# Altium schematic sheet Принципиальная схема Peggy Tracker.SchDoc
size 420 x 297 mm; ENG_APP_DATE: --/--/--; DSN_APP_DATE: --/--/--; CHK_APP_DATE: --/--/--; Scale: 1:1; Разраб.: Иванов; Обозначение документа: АБВГ.123456.001 Э3; Пров.: Петров; Утв.: Сидоров; Наименование организации: ОАО "Ваша фирма"; Перв. применение: АБВГ.123456.000; Наименование изделия 1: Плата; Наименование изделия 2: Схема электрическая; Наименование изделия 3: принципиальная; Нач. отд.: Нач. отд.; Фамилия нач. отд.: Сидоров
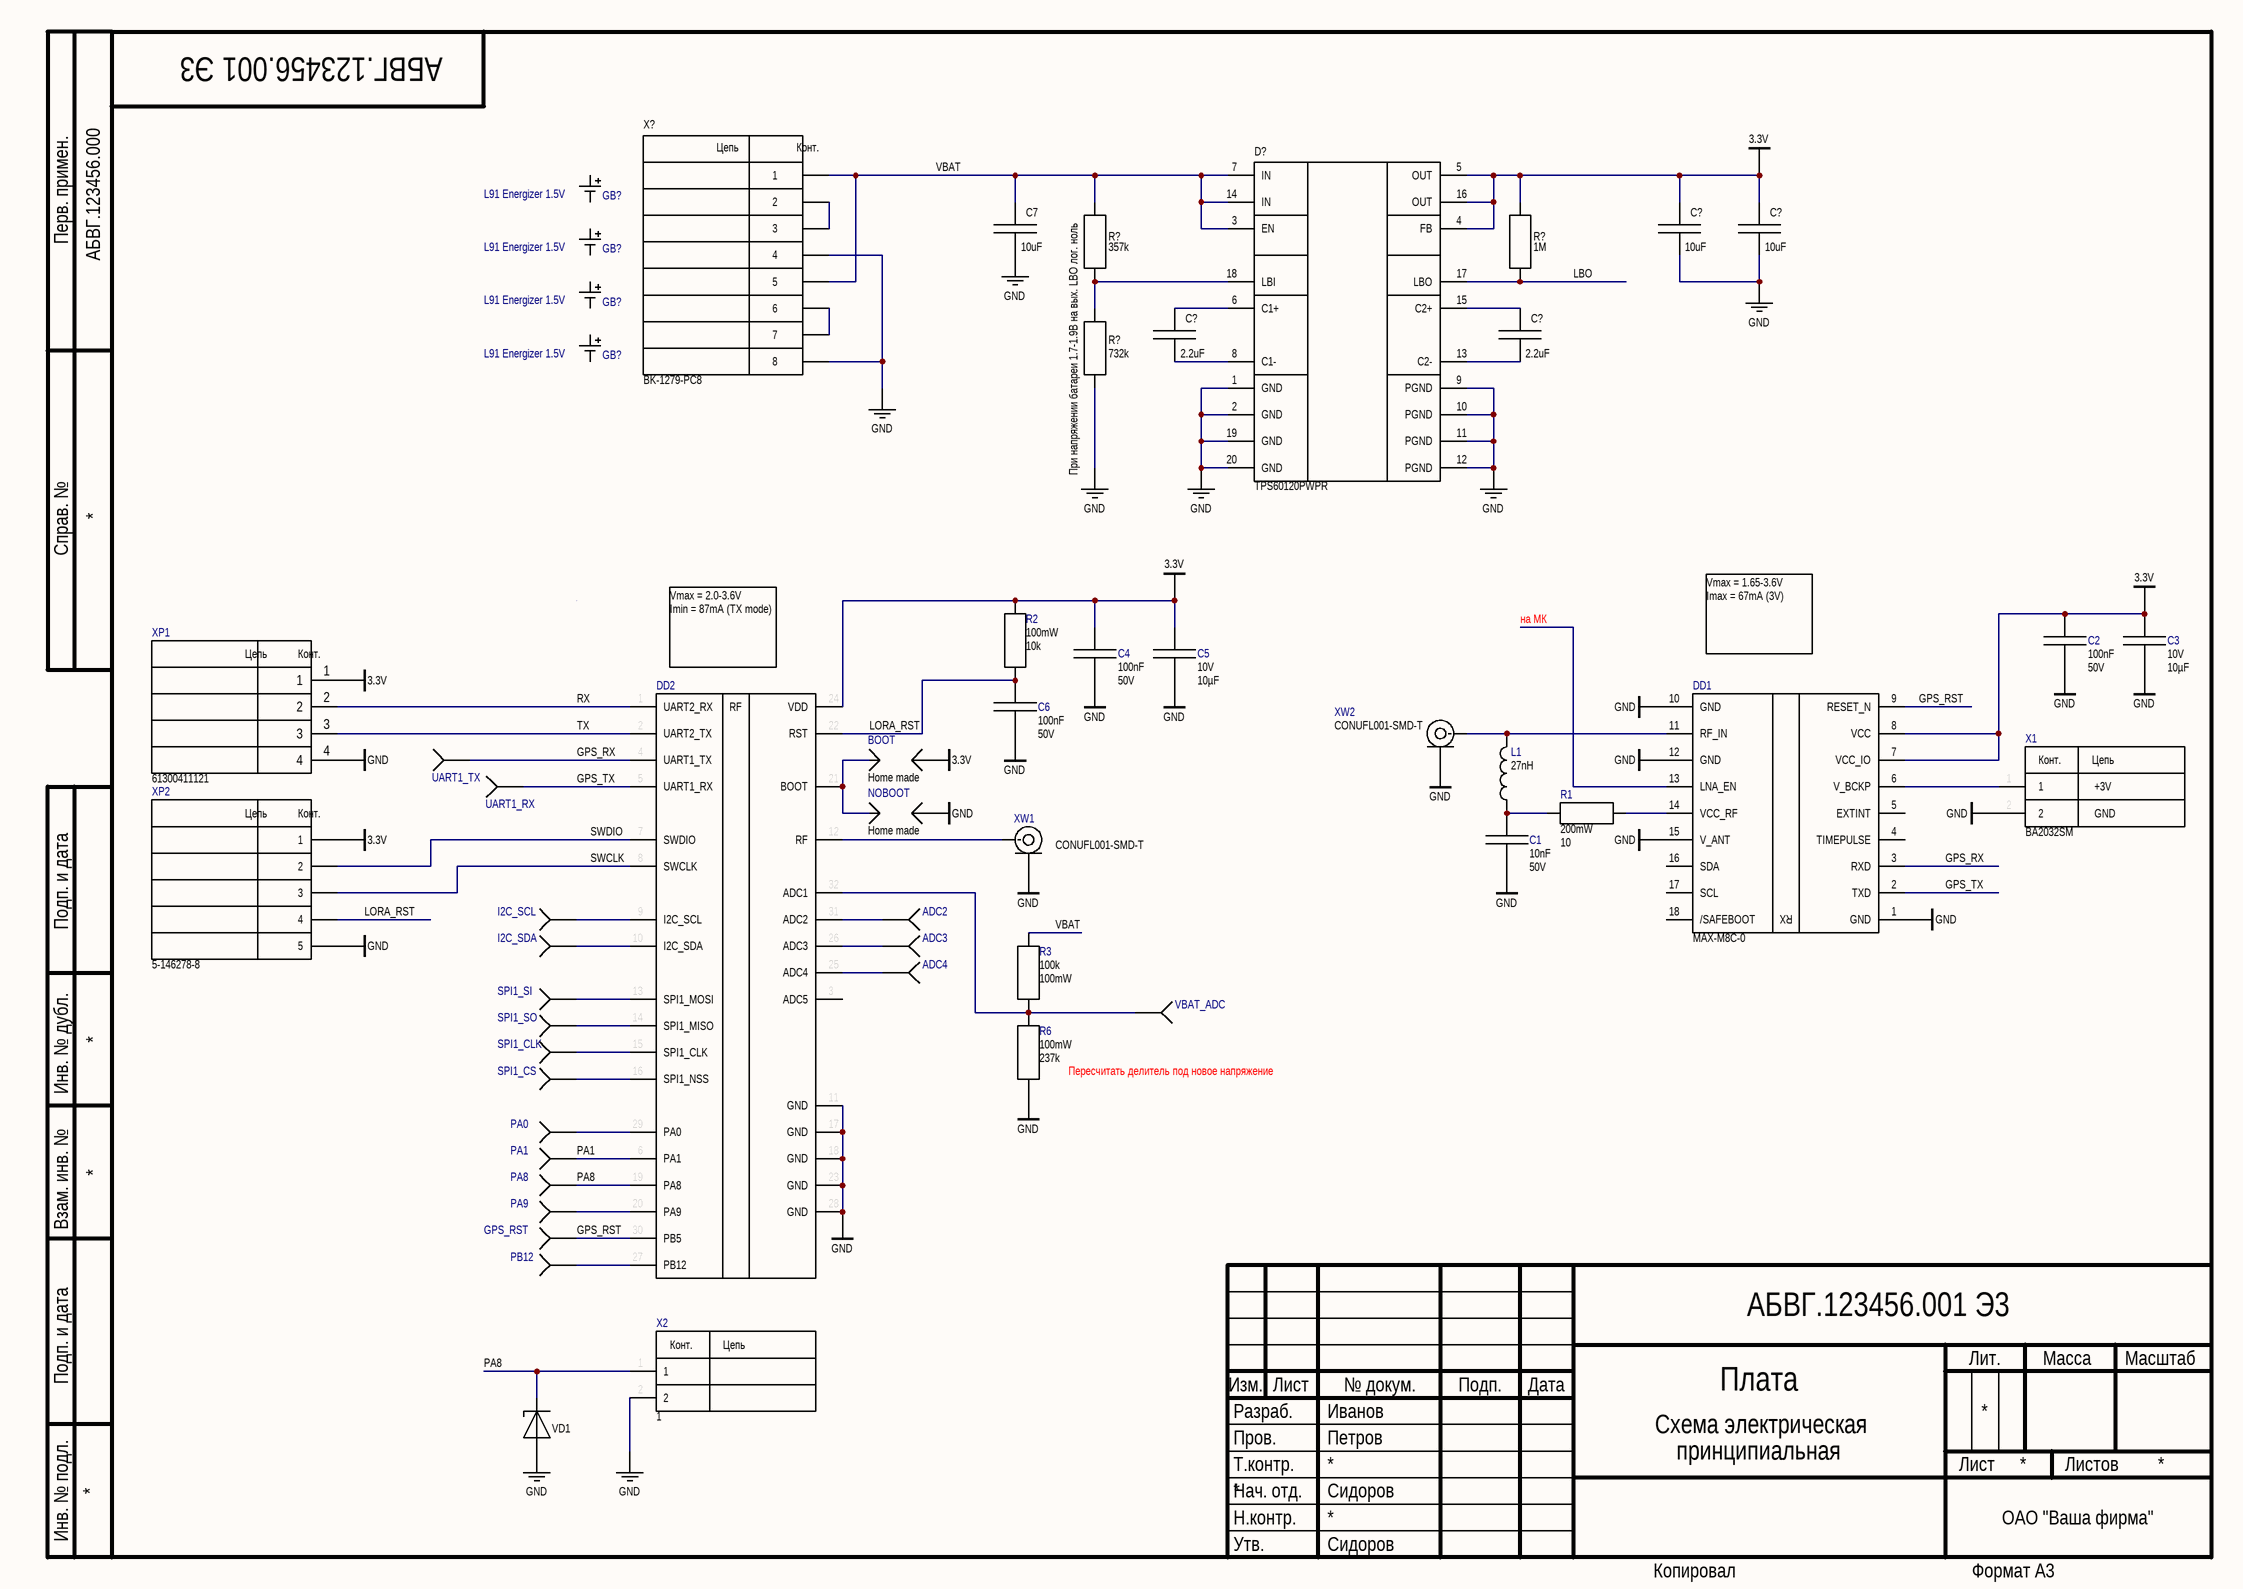
[diagram p0: Принципиальная схема Peggy Tracker.SchDoc]

## Parts
(Parts that share a designator on the sheet are numbered #1, #2 ... from top to bottom, then left to right.)
ADC2  TP_1MM  [New footprint 1]  (value not drawn)
ADC3  TP_1MM  [New footprint 1]  (value not drawn)
ADC4  TP_1MM  [New footprint 1]  (value not drawn)
BOOT  Manufacturer Part Number: Home made  [JUMPER-Footprint-3]  (hidden comment: Jumper_solderable)
C1  value 10nF  Voltage Rating: 50V  [CAPC1608X09N]  (hidden comment: GCM188R71H103KA37D)
C2  value 100nF  Voltage Rating: 50V  [CAPC1608X09N]  (hidden comment: GCM188R71H104KA57D)
C3  Voltage Rating: 10V  Capacitance: 10µF  [CAPC2013X135X45NL10T25]  (hidden comment: CL21Y106KPQVPNE)
C4  value 100nF  Voltage Rating: 50V  [CAPC1608X09N]  (hidden comment: GCM188R71H104KA57D)
C5  Voltage Rating: 10V  Capacitance: 10µF  [CAPC2013X135X45NL10T25]  (hidden comment: CL21Y106KPQVPNE)
C6  value 100nF  Voltage Rating: 50V  [CAPC1608X09N]  (hidden comment: GCM188R71H104KA57D)
C7  10uF  [CH1206C]
C?#1  10uF  [CH1206C]
C?#2  10uF  [CH1206C]
C?#3  2.2uF  [CH0805C]
C?#4  2.2uF  [CH0805C]
D?  TPS60120PWPR  [20-TSSOP (PAD)]
DD1  MAX-M8C-0  [MAXM8C0]
DD2  RAK3172(H)  [RAK3172(H)-Footprint-1]  (value not drawn)
GB?#1  L91 Energizer 1.5V  (mechanical)
GB?#2  L91 Energizer 1.5V  (mechanical)
GB?#3  L91 Energizer 1.5V  (mechanical)
GB?#4  L91 Energizer 1.5V  (mechanical)
GPS_RST  TP_1MM  [New footprint 1]  (value not drawn)
I2C_SCL  TP_1MM  [New footprint 1]  (value not drawn)
I2C_SDA  TP_1MM  [New footprint 1]  (value not drawn)
L1  Inductance: 27nH  [INDC1608X10M]  (hidden comment: LQW18AN27NJ00D)
NOBOOT  Manufacturer Part Number: Home made  [JUMPER-Footprint-3]  (hidden comment: Jumper_solderable)
PA0  TP_1MM  [New footprint 1]  (value not drawn)
PA1  TP_1MM  [New footprint 1]  (value not drawn)
PA8  TP_1MM  [New footprint 1]  (value not drawn)
PA9  TP_1MM  [New footprint 1]  (value not drawn)
PB12  TP_1MM  [New footprint 1]  (value not drawn)
R1  value 10  Power Rating: 200mW  [RESC1608X55X25ML10T15]  (hidden comment: SG73P1JTTD100J)
R2  Power Rating: 100mW  Resistance: 10k  [RESC1608X55X25NL10T15]  (hidden comment: RMCF0603FT10K0)
R3  Resistance: 100k  Power Rating: 100mW  [RESC1608X55X25LL10T15]  (hidden comment: RMCF0603FT100K)
R6  Power Rating: 100mW  Resistance: 237k  [RESC1608X55X25ML10T15]  (hidden comment: ERJ-3EKF2373V)
R?#1  357k  [CH0603R]
R?#2  1M  [CH0603R]
R?#3  732k  [CH0603R]
SPI1_CLK  TP_1MM  [New footprint 1]  (value not drawn)
SPI1_CS  TP_1MM  [New footprint 1]  (value not drawn)
SPI1_SI  TP_1MM  [New footprint 1]  (value not drawn)
SPI1_SO  TP_1MM  [New footprint 1]  (value not drawn)
UART1_RX  TP_1MM  [New footprint 1]  (value not drawn)
UART1_TX  TP_1MM  [New footprint 1]  (value not drawn)
VBAT_ADC  TP_1MM  [New footprint 1]  (value not drawn)
VD1  DESD3V3S1BL-7B  [X1-DFN1006-2 (0402 )]  (value not drawn)
X1  BA2032SM  [MPD-BA2032SM_V]
X2  Manufacturer Part Number: 1  [JST-B2P-VH(LF)(SN)_V]  (hidden comment: B2P-VH(LF)(SN))
X?  BK-1279-PC8  [CON: 0533750810]
XP1  61300411121  [20021311-00010T4LF-Footprint-1]
XP2  Manufacturer Part Number: 5-146278-8  [5-146278-8-Footprint-1]  (hidden comment: 5-146278-5)
XW1  CONUFL001-SMD-T  [u.Fl]
XW2  CONUFL001-SMD-T  [u.Fl]

## Nets
3.3V: BOOT.2 C2.1 C3.2 C4.2 C5.2 C?#1.1 C?#2.1 D?.4(FB) D?.5(OUT) D?.16(OUT) DD1.7(VCC_IO) DD1.8(VCC) DD2.24(VDD) R2.2 R?#2.2 XP1.1 XP2.1
GND: C1.2 C2.2 C3.1 C4.1 C5.1 C6.1 C7.2 C?#1.2 C?#2.2 D?.1(GND) D?.2(GND) D?.9(PGND) D?.10(PGND) D?.11(PGND) D?.12(PGND) D?.19(GND) D?.20(GND) DD1.1(GND) DD1.10(GND) DD1.12(GND) DD1.15(V_ANT) DD2.11(GND) DD2.17(GND) DD2.18(GND) DD2.23(GND) DD2.28(GND) NOBOOT.2 R6.1 R?#3.1 VD1.1(A) X1.2(GND) X2.2 X?.4 X?.8 XP1.4 XP2.5 XW1.2(IN) XW2.2(IN)
GPS_RST: DD1.9(RESET_N) DD2.30(PB5) GPS_RST.1
GPS_RX: DD1.3(RXD) DD2.4(UART1_TX) UART1_TX.1
GPS_TX: DD1.2(TXD) DD2.5(UART1_RX) UART1_RX.1
LBO: D?.17(LBO) R?#2.1
LORA_RST: C6.2 DD2.22(RST) R2.1 XP2.4
PA1: DD2.6(PA1) PA1.1
PA8: DD2.19(PA8) PA8.1 VD1.2(C) X2.1
RX: DD2.1(UART2_RX) XP1.2
SWCLK: DD2.8(SWCLK) XP2.3
SWDIO: DD2.7(SWDIO) XP2.2
TX: DD2.2(UART2_TX) XP1.3
VBAT: C7.1 D?.3(EN) D?.7(IN) D?.14(IN) R3.2 R?#1.2 X?.1 X?.5
NetADC2_1: ADC2.1 DD2.31(ADC2)
NetADC3_1: ADC3.1 DD2.26(ADC3)
NetADC4_1: ADC4.1 DD2.25(ADC4)
NetBOOT_1: BOOT.1 DD2.21(BOOT) NOBOOT.1
NetC1_1: C1.1 L1.1 R1.1
NetC?#3_1: C?#3.1 D?.6(C1+)
NetC?#3_2: C?#3.2 D?.8(C1-)
NetC?#4_1: C?#4.1 D?.15(C2+)
NetC?#4_2: C?#4.2 D?.13(C2-)
NetD?_18: D?.18(LBI) R?#1.1 R?#3.2
NetDD1_6: DD1.6(V_BCKP) X1.1(+3V)
NetDD1_11: DD1.11(RF_IN) L1.2 XW2.1(IN)
NetDD1_14: DD1.14(VCC_RF) R1.2
NetDD2_9: DD2.9(I2C_SCL) I2C_SCL.1
NetDD2_10: DD2.10(I2C_SDA) I2C_SDA.1
NetDD2_12: DD2.12(RF) XW1.1(IN)
NetDD2_13: DD2.13(SPI1_MOSI) SPI1_SI.1
NetDD2_14: DD2.14(SPI1_MISO) SPI1_SO.1
NetDD2_15: DD2.15(SPI1_CLK) SPI1_CLK.1
NetDD2_16: DD2.16(SPI1_NSS) SPI1_CS.1
NetDD2_20: DD2.20(PA9) PA9.1
NetDD2_27: DD2.27(PB12) PB12.1
NetDD2_29: DD2.29(PA0) PA0.1
NetDD2_32: DD2.32(ADC1) R3.1 R6.2 VBAT_ADC.1
NetX?_2: X?.2 X?.3
NetX?_6: X?.6 X?.7

Not connected (* = marked no-connect by the designer): DD1 4(TIMEPULSE) 5(EXTINT) 13(LNA_EN) 16(SDA) 17(SCL) 18(/SAFEBOOT); DD2 3(ADC5); GB?#1 1(+) 2(-); GB?#2 1(+) 2(-); GB?#3 1(+) 2(-); GB?#4 1(+) 2(-)

## Notes on the sheet
- (near R?#1) При напряжении батареи 1.7-1.9В на вых. LBO лог. ноль
- (near DD2) Vmax = 2.0-3.6V
  Imin = 87mA (TX mode)
- на МК
- (near DD1) Vmax = 1.65-3.6V
  Imax = 67mA (3V)
- Пересчитать делитель под новое напряжение
- Перв. примен.
- Справ. №
- Подп. и дата
- Инв. № дубл.
- Взам. инв. №
- Разраб.
- Изм.
- Лист
- № докум.
- Подп.
- Дата
- Лит.
- Масса
- Масштаб
- Пров.
- Т.контр.
- Листов
- Инв. № подл.
- Утв.
- Н.контр.
- Копировал
- Формат А3
- (in symbol 8-Connector) Цепь; Конт.
- (in symbol CMP-002-00003-13) Конт.; Цепь
- (in symbol CMP-002-00025-5) Конт.; Цепь
- (in symbol CMP-002-00092-3) Цепь; Конт.
- (in symbol CMP-002-00131-1) Цепь; Конт.
- (in symbol CMP-021-00007-2) RX

## Library data of the parts
ADC2-ADC4 GPS_RST I2C_SCL I2C_SDA PA0 PA1 PA8 PA9 PB12 SPI1_CLK SPI1_CS SPI1_SI SPI1_SO UART1_RX UART1_TX VBAT_ADC = CMP-002-00080-4: Test Point, 1mm diam; Manufacturer: SRG_DEV; Pins: 1; Manufacturer Part Number: TP_1MM
BOOT NOBOOT = CMP-002-00130-2: Solderable Jumper; Connector Type: Male Pin; Gender: Male; Pins: 2; Min Operating Temperature: -40°C; Manufacturer: Home made; Max Operating Temperature: 125°C
C1 = CMP-001-00124-4: CAP CER 10000PF 50V X7R 0603; Manufacturer: Murata; Lybrary Path: Capacitors.SchLib; Tolerance: 10%; ComponentLink5Description: https://datasheet.ciiva.com/132/product-132007.pdf?src-supplier=Digi-Key; Lead Free: Lead Free; ComponentLink3Description: https://datasheet.ciiva.com/11789/0900766b80ef92d0-11789046.pdf?src-supplier=RSComponents; Stock 1: 4826468; Width: 0.031inch; RoHS: Yes; Radiation Hardening: No; Case/Package: 0603; Voltage: 50V; ComponentLink4URL: https://datasheet.ciiva.com/18183/getdatasheetpartid-178897-18183622.pdf?src-supplier=Verical; ComponentLink1Description: https://datasheet.ciiva.com/16624/product-16624561.pdf?src-supplier=Avnet+Europe; Pricing 1: 1=0,17000, 10=0,11900, 50=0,06740, 100=0,05580, 500=0,03912, 1000=0,03239 (USD); Mount: Surface Mount; ComponentLink6Description: https://datasheet.ciiva.com/16213/s0717e-16213899.pdf?src-supplier=Future+Electronics; ComponentLink4Description: https://datasheet.ciiva.com/18183/getdatasheetpartid-178897-18183622.pdf?src-supplier=Verical; ComponentLink1URL: https://datasheet.ciiva.com/16624/product-16624561.pdf?src-supplier=Avnet+Europe; ComponentLink3URL: https://datasheet.ciiva.com/11789/0900766b80ef92d0-11789046.pdf?src-supplier=RSComponents; ComponentLink6URL: https://datasheet.ciiva.com/16213/s0717e-16213899.pdf?src-supplier=Future+Electronics; Depth: 0.8mm; RoHS Compliant: Yes; Case Code (Metric): 1608; ComponentLink2Description: https://datasheet.ciiva.com/132/product-132006.pdf?src-supplier=Digi-Key; Height: 0.8mm; Length: 1.6mm; Packaging: Tape and Reel; REACH SVHC: No SVHC; Thickness: 0.035inch; Dielectric: X7R; Package Quantity: 1; Min Operating Temperature: -55°C; Ratings: AEC-Q200; Voltage Rating (DC): 50V; Construction: Flat; ComponentLink5URL: https://datasheet.ciiva.com/132/product-132007.pdf?src-supplier=Digi-Key; Max Operating Temperature: 125°C; ComponentLink2URL: https://datasheet.ciiva.com/132/product-132006.pdf?src-supplier=Digi-Key; Manufacturer Part Number: GCM188R71H103KA37D; Source: Meteo_1.SCHLIB; Design Item ID: 1_7; Termination: SMD/SMT; Series: GCM
C2 C4 C6 = CMP-001-00128-5: CAP CER 0.1UF 50V X7R 0603; Manufacturer: Murata; Tolerance: 10%; Approvals: CSA,UR; Color: Grey; RoHS Compliant: Yes; Case/Package: 0603; Max Operating Temperature: 125°C; Min Operating Temperature: -55°C; Case Code (Metric): 1608; Depth: 0.8mm; Dielectric: X7R; Height: 0.8mm; Length: 1.6mm; Mount: Surface Mount; Package Quantity: 1; Packaging: Tape and Reel; Radiation Hardening: No; Series: GCM; Termination: SMD/SMT; Thickness: 0.035inch; Width: 0.031inch; Manufacturer Part Number: GCM188R71H104KA57D; Lead Free: Lead Free; REACH SVHC: No SVHC; Voltage: 50V; ComponentLink1Description: https://datasheet.ciiva.com/16624/product-16624562.pdf?src-supplier=Avnet+Europe; ComponentLink1URL: https://datasheet.ciiva.com/16624/product-16624562.pdf?src-supplier=Avnet+Europe; ComponentLink2Description: https://datasheet.ciiva.com/133/product-133574.pdf?src-supplier=Digi-Key; ComponentLink2URL: https://datasheet.ciiva.com/133/product-133574.pdf?src-supplier=Digi-Key; ComponentLink3Description: https://datasheet.ciiva.com/133/product-133575.pdf?src-supplier=Digi-Key; ComponentLink3URL: https://datasheet.ciiva.com/133/product-133575.pdf?src-supplier=Digi-Key; ComponentLink4Description: https://datasheet.ciiva.com/18183/getdatasheetpartid-98693-18183626.pdf?src-supplier=Verical; ComponentLink4URL: https://datasheet.ciiva.com/18183/getdatasheetpartid-98693-18183626.pdf?src-supplier=Verical; ComponentLink5Description: https://datasheet.ciiva.com/11786/0900766b80ef92d0-11786863.pdf?src-supplier=RSComponents; ComponentLink5URL: https://datasheet.ciiva.com/11786/0900766b80ef92d0-11786863.pdf?src-supplier=RSComponents; ComponentLink6Description: https://datasheet.ciiva.com/133/product-133573.pdf?src-supplier=Digi-Key; ComponentLink6URL: https://datasheet.ciiva.com/133/product-133573.pdf?src-supplier=Digi-Key; ComponentLink7Description: https://datasheet.ciiva.com/2989/product-2989242.pdf?src-supplier=Avnet; ComponentLink7URL: https://datasheet.ciiva.com/2989/product-2989242.pdf?src-supplier=Avnet; ComponentLink8Description: https://datasheet.ciiva.com/16497/product-16497247.pdf?src-supplier=Future+Electronics; ComponentLink8URL: https://datasheet.ciiva.com/16497/product-16497247.pdf?src-supplier=Future+Electronics; Construction: Flat; Design Item ID: 1_16; Pricing 1: 1=0,11000, 10=0,07900, 50=0,04280, 100=0,03500, 500=0,02502, 1000=0,01966 (USD); Ratings: AEC-Q200; RoHS: Yes; Source: Meteo_1.SCHLIB; Stock 1: 4755830; Voltage Rating (DC): 50V
C3 C5 = CMP-001-00143-4: CAP CER 10UF 10V X7S 0805; Manufacturer: Samsung; Value: 10µF; Tolerance: 10%; Manufacturer Part Number: CL21Y106KPQVPNE; Packaging: Tape and Reel; Max Operating Temperature: 125°C; RoHS Compliant: Yes; Case/Package: 0805; Features: Soft Termination; Case Code (Imperial): 0805; Thickness: 0.055inch; Length: 0.079inch; Min Operating Temperature: -55°C; Width: 0.049inch; Ratings: AEC-Q200; Mount: Surface Mount; Case Code (Metric): 2012; Lead Free: Lead Free
C7 C?#1 C?#2 = Capacitor: Cap Ceramic 10uF 16V X7R 20% SMD 1206 125°C Embossed T/R; Manufacturer: Samsung Electro-Mechanics; Model: CL31B106MOHNNNE; HelpURL: https://www.digikey.com/en/products/detail/samsung-electro-mechanics/CL31B106MOHNNNE/5961125; ComponentKind: 1206 (3216 Metric); Value: 10uF; Supplier 1: Digi-Key; Supplier Part Number 1: 1276-6641-1-ND; Manufacturer Part Number: CL31B106MOHNNNE; RoHS: Yes; Category: Ceramic Capacitors; Stock: 1126; Pricing: 1=0,22000, 10=0,15000, 50=0,09000, 100=0,07600, 500=0,05202, 1000=0,04602 (USD); Mount: Surface Mount; Case/Package: 1206; Case Code (Metric): 3216; Case Code (Imperial): 1206; Min Operating Temperature: -55°C; Max Operating Temperature: 125°C; Capacitance: 10uF; Tolerance: 20%; Dielectric: X7R; Voltage Rating (DC): 16V; Packaging: Tape and Reel; Voltage Rating: 16V; Length: 0.126inch; Width: 0.063inch; Thickness: 0.071inch; RoHS Compliant: Yes; ComponentLink1URL: http://www.samsungsem.com/kr/support/product-search/mlcc/CL31B106MOHNNNE.jsp?src-supplier=Digi-Key; ComponentLink1Description: http://www.samsungsem.com/kr/support/product-search/mlcc/CL31B106MOHNNNE.jsp?src-supplier=Digi-Key
C?#3 C?#4 = Capacitor: Cap Ceramic 10uF 16V X7R 20% SMD 1206 125°C Embossed T/R; Manufacturer: Murata Electronics; Manufacturer Part Number: CL31B106MOHNNNE; Model: GRM21BR71E225KE11L; Voltage Rating: 25V; HelpURL: https://www.digikey.com/en/products/detail/murata-electronics/GRM21BR71E225KE11L/6606096; ComponentKind: 0805 (2012 Metric); Value: 2.2uF; RoHS: Yes; Category: Ceramic Capacitors; Stock: 1126; Pricing: 1=0,22000, 10=0,15000, 50=0,09000, 100=0,07600, 500=0,05202, 1000=0,04602 (USD); Mount: Surface Mount; Case/Package: 0805; Case Code (Metric): 3216; Min Operating Temperature: -55°C; Max Operating Temperature: 125°C; Capacitance: 2.2uF; Tolerance: 20%; Dielectric: X7R; Voltage Rating (DC): 16V; Packaging: Tape and Reel; Length: 0.126inch; Width: 0.063inch; Thickness: 0.071inch; RoHS Compliant: Yes; ComponentLink1URL: http://www.samsungsem.com/kr/support/product-search/mlcc/CL31B106MOHNNNE.jsp?src-supplier=Digi-Key; ComponentLink1Description: http://www.samsungsem.com/kr/support/product-search/mlcc/CL31B106MOHNNNE.jsp?src-supplier=Digi-Key; Supplier 1: Digi-Key; Supplier Part Number 1: 490-14467-1-ND
D? = TPS60120PWPR: Charge Pump Switching Regulator 3.3V; Manufacturer: Texas Instruments; Model: TPS60120PWPR; HelpURL: https://www.digikey.com/en/products/detail/texas-instruments/TPS60120PWPR/1671965; ComponentKind: PowerTSSOP; Supplier 1: Digi-Key; Supplier Part Number 1: 296-48756-1-ND
DD1 = CMP-021-00007-2: IC Receiver Gps/gnss 18LCC; Manufacturer: u-blox; Manufacturer Part Number: MAX-M8C-0; RoHS Compliant: Yes
DD2 = CMP-00025-00003-1: RAK3172 WisDuo LPWAN Module; Manufacturer: RAK Wireless; Manufacturer Part Number: RAK3172(H)
GB?#1-GB?#4 = CMP-006-0003-3: AA Lithium Iron Disulfide 1.5 V Battery Non-Rechargeable (Primary)
L1 = CMP-00081-1: FIXED IND 27NH 440MA 210MOHM SMD; Manufacturer: Murata; Tolerance: 5%; Test Frequency: 100MHz; Q Factor: 40; Self Resonant Frequency: 3.7GHz; Core Material: Non-Magnetic; Shielding: Unshielded; DC Resistance (DCR): 210mR; Depth: 1mm; Saturation Current: 440mA; Mount: Surface Mount; Resistor Type: Wirewound; Military Standard: Not; Max DC Current: 440mA; Length: 1.6mm; Rated Current-Max: 440mA; Case Code (Imperial): 0603; Height - Seated (Max): 0.039inch; Current Rating: 440mA; Height: 0.8mm; Manufacturer Part Number: LQW18AN27NJ00D; Case/Package: 0603; Lead Free: Lead Free; Case Code (Metric): 1608; Max Operating Temperature: 125°C; Min Operating Temperature: -55°C; DC Current: 440mA; Packaging: Tape and Reel; Width: 0.8mm; Radiation Hardening: No; Termination: SMD/SMT; RoHS Compliant: Yes; Package Quantity: 4000; Series: LQW18A_00; Weight: 0.000106oz
R1 = CMP-00014-2: RES SMD 10 OHM 5% 1/5W 0603; Manufacturer: KOA Speer; Voltage Rating (DC): 50V; Component Comment: 10 200mW; Temperature Coefficient: 100ppm/°C; Max Operating Temperature: 155°C; Resistor Type: Thick Film; Length: 1.6mm; Series: SG73; Tolerance: 5%; Height: 0.45mm; Packaging: Tape and Reel; Width: 0.8mm; RoHS Compliant: Yes; Resistance: 10; Weight: 7.1E-05oz; Case Code (Imperial): 0603; Case/Package: 0603; Min Operating Temperature: -55°C; Case Code (Metric): 1608; Voltage Rating: 50V; Termination: SMD/SMT; Manufacturer Part Number: SG73P1JTTD100J
R2 = CMP-009-00252-4: RES SMD 10K OHM 1% 1/10W 0603; Manufacturer: Stackpole Electronics Inc; Temperature Coefficient: 100ppm/°C; Voltage Rating: 75V; Component Comment: 10k 100mW; Features: Automotive AEC-Q200; Lead Free: Lead Free; Case/Package: 0603; Min Operating Temperature: -55°C; Max Power Dissipation: 100mW; Case Code (Metric): 1608; Contact Plating: Tin,Matte; Number of Terminations: 2; Military Standard: Not; Size Code: 0603; Manufacturer Part Number: RMCF0603FT10K0; Pins: 2; Width: 0.031inch; Radiation Hardening: No; Mount: Surface Mount; Case Code (Imperial): 0603; Depth: 0.8mm; Max Operating Temperature: 155°C; Height: 0.022inch; Tolerance: 1%; Resistor Type: Thick Film; RoHS Compliant: Yes; Packaging: Tape and Reel; Construction: Rectangular; Series: RMCF; Length: 1.55mm
R3 = CMP-009-00253-1: RES 100K OHM 1% 1/10W 0603; Manufacturer: Stackpole Electronics Inc; Component Comment: 100k 100mW; Temperature Coefficient: 100ppm/°C; Working Voltage: 75V; Packaging: Tape and Reel; Height: 0.022inch; Features: Automotive AEC-Q200; RoHS Compliant: Yes; Case/Package: 0603; Contact Plating: Tin,Matte; Series: RMCF; Manufacturer Part Number: RMCF0603FT100K; Max Operating Temperature: 155°C; Max Power Dissipation: 100mW; Depth: 0.8mm; Radiation Hardening: No; Min Operating Temperature: -55°C; Military Standard: Not; Tolerance: 1%; Mount: Surface Mount; Construction: Rectangular; Case Code (Imperial): 0603; Width: 0.031inch; Number of Terminations: 2; Resistor Type: Thick Film; Lead Free: Lead Free; Case Code (Metric): 1608; Length: 1.55mm
R6 = CMP-009-00311-2: RES SMD 237K OHM 1% 1/10W 0603; Manufacturer: Panasonic; Voltage Rating: 75V; Voltage Rating (DC): 50V; Component Comment: 237k 100mW; Temperature Coefficient: 100ppm/°C; Min Operating Temperature: -55°C; Features: Automotive AEC-Q200; Width: 0.8mm; RoHS Compliant: Yes; Package Quantity: 1; Construction: Rectangular; Height: 0.45mm; Length: 1.6mm; Termination: SMD/SMT; Depth: 0.8mm; Packaging: Tape and Reel; Resistance Tolerance: 1%; Number of Terminations: 2; Military Standard: Not; Case Code (Imperial): 0603; Mount: Surface Mount; Tolerance: 1%; Case Code (Metric): 1608; Case/Package: 0603; Series: ERJ; Max Operating Temperature: 155°C; Contact Plating: Tin; Technology: THICK FILM; REACH SVHC: Yes; Max Power Dissipation: 100mW; Radiation Hardening: No; Resistor Type: Thick Film; Manufacturer Part Number: ERJ-3EKF2373V
R?#1 = Resistor: Manufacturer: YAGEO; Model: RC0603FR-07357KL; HelpURL: https://www.digikey.com/en/products/detail/yageo/RC0603FR-07357KL/727177*; ComponentKind: 0603 (1608 Metric); Value: 357k; Supplier 1: Digi-Key; Supplier Part Number 1: 311-357KHRCT-ND
R?#2 = Resistor: Manufacturer: YAGEO; Model: RC0603FR-071ML; HelpURL: https://www.digikey.com/en/products/detail/yageo/RC0603FR-071ML/726844; ComponentKind: 0603 (1608 Metric); Value: 1M; Supplier 1: Digi-Key; Supplier Part Number 1: 311-1.00MHRCT-ND
R?#3 = Resistor: Manufacturer: YAGEO; Model: RC0603FR-07732KL; HelpURL: https://www.digikey.com/en/products/detail/yageo/RC0603FR-07732KL/727376; ComponentKind: 0603 (1608 Metric); Value: 732k; Supplier 1: Digi-Key; Supplier Part Number 1: 311-732KHRCT-ND
VD1 = Diod Zener: Manufacturer: Diodes Incorporated; ComponentKind: X1-DFN1006-2; Model: DESD3V3S1BL-7B; HelpURL: https://www.digikey.com/en/products/detail/diodes-incorporated/DESD3V3S1BL-7B/4567778; Supplier 1: Digi-Key; Supplier Part Number 1: DESD3V3S1BL-7BDICT-ND; ComponentLink1Description: HelpURL; ComponentLink1URL: https://www.digikey.com/en/products/detail/diodes-incorporated/DESD3V3S1BL-7B/4567778
X1 = CMP-002-00003-13: Battery Holder Coin 20MM SMD; Manufacturer: Memory Protection Devices; Number of Cells: 1; Diameter: 20mm; Min Operating Temperature: -40°C; Lead Free: Lead Free; Case/Package: BA2032SM; Mount: Surface Mount,PCB; Pins: 2; Termination: SMD/SMT; Connector Type: BatteryHolder; Max Operating Temperature: 225°C; RoHS Compliant: True; Manufacturer Part Number: BA2032SM; Mounting Technology: SM; Package Quantity: 100; Series: -
X2 = CMP-002-00025-5: Male Header, Pitch 3.96 mm, 1 x 2 Position, Height 10.9 mm, Tail Length 3.7 mm, -25 to 85 degC, RoHS, Bulk; Manufacturer: JST; Package Reference: B2P-VH(LF)(SN); Pins: 2; Case/Package: B2P-VH(LF)(SN); Datasheet Version: May-16; Min Operating Temperature: -25°C; Datasheet URL: http://www.jst-mfg.com/product/pdf/eng/eVH.pdf; Mounting Technology: TH; Connector Type: Header; Max Operating Temperature: 85°C; Package Description: Male Header, Pitch 3.96 mm, 1 x 2 Position, Height 10.9 mm, Tail Length 3.7 mm; Manufacturer URL: http://www.jst.com/home2.html; Gender: Male; RoHS Compliant: Unknown
X? = 8-Connector: Battery Holder (Open) AA 4 Cell PC Pin; Manufacturer: MPD (Memory Protection Devices); Model: BK-1279-PC8; HelpURL: https://www.digikey.com/en/products/detail/mpd-memory-protection-devices/BK-1279-PC8/1640077; ComponentKind: Battery Holder (Open) AA 4 Cell PC Pin; Supplier 1: Digi-Key; Supplier Part Number 1: BK-1279-PC8-ND
XP1 = CMP-002-00092-3: Conn Unshrouded Header HDR 4 POS 2.54mm Solder ST Thru-Hole Bag; Manufacturer: Würth Elektronik; Position: 4; Connector Type: Male Pin; Gender: Male; Pitch: 0.1inch; Number of Rows: 1; Number of Positions: 4; Contact Mating Length: 0.236inch; Color: Black; Contact Material: Copper; Lead Free: Lead Free; RoHS Compliant: Yes; Packaging: Bulk; Mount: Through Hole; Number of Contacts: 4; REACH SVHC: Unknown; Contact Plating: Gold; Termination: Solder; Pins: 4; Manufacturer Part Number: 61300411121
XP2 = CMP-002-00131-1: Conn Unshrouded Header HDR 5 POS 2.54mm Solder ST Thru-Hole Carton; Manufacturer: TE Connectivity; Mating Connector Lock: No (Without); PCB Mounting Orientation: Vertical; Board Standoff: Yes (With); Connector Type: Plug,Header,Pin; PCB Mount Retention: Without; Keyed: No; PCB Thickness: 0.062inch; High Temperature Housing: Yes; Number of Positions: 5; Contact Post Length: 0.12inch; Approvals: CSA; Gender: Male; Contact Current Rating: 3A; Radiation Hardening: No; Gasket: No (Without); Contact Protection: No (Without); Contact Gender: Male; Housing Material: Polymer; Termination: Through Hole; Series: AMPMODU MOD II; Selectively Loaded: No (Without); Row Spacing: 2.54mm; Flammability Rating: UL94 V-0; Orientation: Straight; Mount: Through Hole; Number of Rows: 1; Stabilizers: No (Without); Min Operating Temperature: -65°C; Depth: 2.34mm; ELV: Compliant; Max Operating Temperature: 105°C; Package Quantity: 480; High Speed Serial Data Connector: No; RoHS Compliant: Yes; Packaging: Carton; Length: 12.29mm; Contact Mating Length: 0.23inch; Contact Shape: Square; Number of Contacts: 5; Pins: 5; Color: Black; Strain Relief: No (Without); Pitch: 2.54mm; Contact Plating: Tin; Lead Free: Lead Free; Mating Alignment: No (Without); Contact Type: Male Pin; Contact Material: Bronze; Housing Color: Black
XW1 XW2 = CMP-002-00096-2: CONN UMC JACK STR SMD; Manufacturer: Linx Technologies Inc.; Number of Ports: 1; Body Material: Copper Alloy; Max Frequency: 6GHz; Dielectric Material: Polymer; Body Plating: Gold; Connector Type: Male Pin; Impedance: 50R; Packaging: Tape and Reel; Min Operating Temperature: -40°C; Pins: 2; Fastening Type: Snap; Contact Plating: Gold; Contact Material: Brass; Mount: Surface Mount; Termination: Solder; Housing Color: White; Max Operating Temperature: 90°C; RoHS Compliant: Yes; Manufacturer Part Number: CONUFL001-SMD-T